# Altium project Humpback.PrjPCB (part 4 of 4)
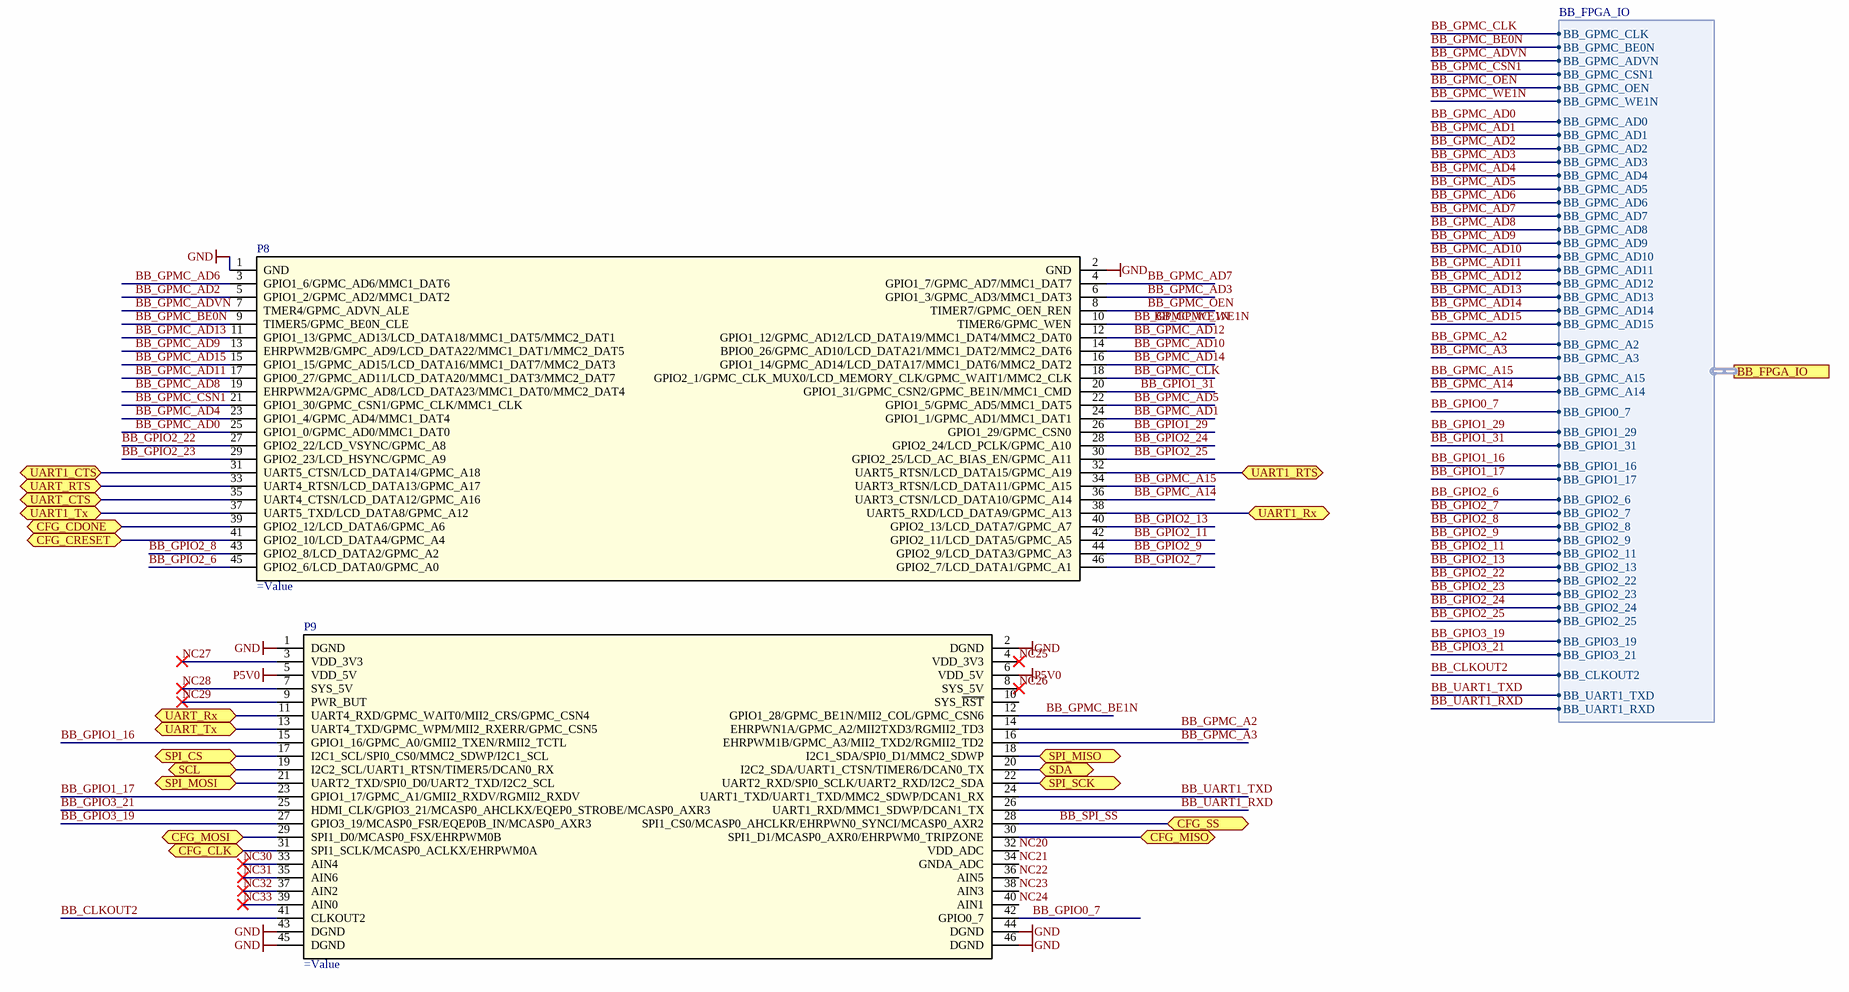
[diagram p11: Beaglebone_black.SchDoc]

## Nets that join several sheets
GND: FPGA_LVDS (27 pins), FPGA (14 pins), I2C_switch (14 pins), Supply (96 pins), FPGA_Config (18 pins), ESP32 (5 pins), Orange_pi_zero (5 pins), STM32_Nucleo_144 (10 pins), Wiznet (PCBM2.J2-17 PCBM2.J2-18 PCBM2.J2-19), Beaglebone_black (8 pins)
P3V3: FPGA (15 pins), Supply (34 pins), FPGA_Config (21 pins), ESP32 (PCBM1.2 R119.1 R122.1 W1.1), Wiznet (PCBM2.J2-1 PCBM2.J2-2 PCBM2.J2-3)
P3V3MP: FPGA_LVDS (J1.30 J2.30 J3.30), I2C_switch (27 pins), Supply (10 pins)
P5V0: Supply (24 pins), Orange_pi_zero (MOD1.2 MOD1.4), STM32_Nucleo_144 (MOD2.9a), Beaglebone_black (P9.5 P9.6)
P12V0: FPGA_LVDS (6 pins), Supply (11 pins)
BB_CLKOUT2: FPGA (U1.R9), Beaglebone_black (P9.41)
BB_GPIO0_7: FPGA (U1.R14), Beaglebone_black (P9.42)
BB_GPIO1_16: FPGA (U1.A16), Beaglebone_black (P9.15)
BB_GPIO1_17: FPGA (U1.R3), Beaglebone_black (P9.23)
BB_GPIO1_29: FPGA (U1.D11), Beaglebone_black (P8.26)
BB_GPIO1_31: FPGA (U1.D14), Beaglebone_black (P8.20)
BB_GPIO2_6: FPGA (U1.D16), Beaglebone_black (P8.45)
BB_GPIO2_7: FPGA (U1.C16), Beaglebone_black (P8.46)
BB_GPIO2_8: FPGA (U1.E16), Beaglebone_black (P8.43)
BB_GPIO2_9: FPGA (U1.D15), Beaglebone_black (P8.44)
BB_GPIO2_11: FPGA (U1.F15), Beaglebone_black (P8.42)
BB_GPIO2_13: FPGA (U1.F16), Beaglebone_black (P8.40)
BB_GPIO2_22: FPGA (U1.C11), Beaglebone_black (P8.27)
BB_GPIO2_23: FPGA (U1.C10), Beaglebone_black (P8.29)
BB_GPIO2_24: FPGA (U1.E10), Beaglebone_black (P8.28)
BB_GPIO2_25: FPGA (U1.D4), Beaglebone_black (P8.30)
BB_GPIO3_19: FPGA (U1.P4), Beaglebone_black (P9.27)
BB_GPIO3_21: FPGA (U1.R4), Beaglebone_black (P9.25)
BB_GPMC_A2: FPGA (U1.T7), Beaglebone_black (P9.14)
BB_GPMC_A3: FPGA (U1.T1), Beaglebone_black (P9.16)
BB_GPMC_A14: FPGA (U1.F9), Beaglebone_black (P8.36)
BB_GPMC_A15: FPGA (U1.B7), Beaglebone_black (P8.34)
BB_GPMC_AD0: FPGA (U1.C12), Beaglebone_black (P8.25)
BB_GPMC_AD1: FPGA (U1.E11), Beaglebone_black (P8.24)
BB_GPMC_AD2: FPGA (U1.J12), Beaglebone_black (P8.5)
BB_GPMC_AD3: FPGA (U1.J11), Beaglebone_black (P8.6)
BB_GPMC_AD4: FPGA (U1.C13), Beaglebone_black (P8.23)
BB_GPMC_AD5: FPGA (U1.C14), Beaglebone_black (P8.22)
BB_GPMC_AD6: FPGA (U1.J14), Beaglebone_black (P8.3)
BB_GPMC_AD7: FPGA (U1.J13), Beaglebone_black (P8.4)
BB_GPMC_AD8: FPGA (U1.E13), Beaglebone_black (P8.19)
BB_GPMC_AD9: FPGA (U1.G13), Beaglebone_black (P8.13)
BB_GPMC_AD10: FPGA (U1.G14), Beaglebone_black (P8.14)
BB_GPMC_AD11: FPGA (U1.G10), Beaglebone_black (P8.17)
BB_GPMC_AD12: FPGA (U1.E14), Beaglebone_black (P8.12)
BB_GPMC_AD13: FPGA (U1.H14), Beaglebone_black (P8.11)
BB_GPMC_AD14: FPGA (U1.F14), Beaglebone_black (P8.16)
BB_GPMC_AD15: FPGA (U1.F13), Beaglebone_black (P8.15)
BB_GPMC_ADVN: FPGA (U1.H12), Beaglebone_black (P8.7)
BB_GPMC_BE0N: FPGA (U1.G16), Beaglebone_black (P8.9)
BB_GPMC_CLK: FPGA (U1.H11), Beaglebone_black (P8.18)
BB_GPMC_CSN1: FPGA (U1.D13), Beaglebone_black (P8.21)
BB_GPMC_OEN: FPGA (U1.H13), Beaglebone_black (P8.8)
BB_GPMC_WE1N: FPGA (U1.G15), Beaglebone_black (P8.10)
BB_UART1_RXD: FPGA (U1.R5), Beaglebone_black (P9.26)
BB_UART1_TXD: FPGA (U1.T3), Beaglebone_black (P9.24)
CFG_CDONE: FPGA_Config (R34.1), ESP32 (PCBM1.5), Orange_pi_zero (MOD1.10), STM32_Nucleo_144 (MOD2.18c), Beaglebone_black (P8.39)
CFG_CLK: FPGA_Config (R10.1), ESP32 (PCBM1.30), Orange_pi_zero (MOD1.12), STM32_Nucleo_144 (MOD2.15c), Beaglebone_black (P9.31)
CFG_CRESET: FPGA_Config (R35.1), ESP32 (PCBM1.12), Orange_pi_zero (MOD1.16), STM32_Nucleo_144 (MOD2.20c), Beaglebone_black (P8.41)
CFG_MISO: FPGA_Config (R19.1), ESP32 (PCBM1.37), Orange_pi_zero (MOD1.18), STM32_Nucleo_144 (MOD2.19c), Beaglebone_black (P9.30)
CFG_MOSI: FPGA_Config (R5.1), ESP32 (PCBM1.31), Orange_pi_zero (MOD1.7), STM32_Nucleo_144 (MOD2.13c), Beaglebone_black (P9.29)
CFG_SS: FPGA_Config (R33.1), ESP32 (PCBM1.29), Orange_pi_zero (MOD1.26), STM32_Nucleo_144 (R88.1), Beaglebone_black (P9.28)
EEM0_I2C_SCL: FPGA_LVDS (J1.27), I2C_switch (B18.1 D1.3 IC6.15 R82.1)
EEM0_I2C_SDA: FPGA_LVDS (J1.26), I2C_switch (B17.1 D1.2 IC6.14 R80.1)
EEM1_I2C_SCL: FPGA_LVDS (J2.27), I2C_switch (B12.1 D2.3 IC6.8 R30.1)
EEM1_I2C_SDA: FPGA_LVDS (J2.26), I2C_switch (B11.1 D2.2 IC6.7 R29.1)
EEM2_I2C_SCL: FPGA_LVDS (J3.27), I2C_switch (5 pins)
EEM2_I2C_SDA: FPGA_LVDS (J3.26), I2C_switch (5 pins)
ESP32_IO2: FPGA (U1.D9), ESP32 (PCBM1.24)
ESP32_IO4: FPGA (U1.D7), ESP32 (PCBM1.26)
ESP32_IO22: FPGA (U1.C7), ESP32 (PCBM1.36)
ESP32_IO34: FPGA (U1.E9), ESP32 (PCBM1.6)
ESP32_IO35: FPGA (U1.C9), ESP32 (PCBM1.7)
FPGA_CDONE: FPGA (U1.M10), FPGA_Config (5 pins)
FPGA_CRESET: FPGA (U1.N11), FPGA_Config (JP1.9 R8.2 R35.2 R57.1)
FPGA_CSBSEL0: FPGA (U1.K11), FPGA_Config (R48.2 SW4.7)
FPGA_CSBSEL1: FPGA (U1.P13), FPGA_Config (R70.2 SW4.8)
FPGA_SCK: FPGA (U1.R11), FPGA_Config (5 pins)
FPGA_SCL: FPGA (U1.M12), I2C_switch (IC6.4 R22.1)
FPGA_SDA: FPGA (U1.T16), I2C_switch (IC6.3 R23.1)
FPGA_SDI: FPGA (U1.P11), FPGA_Config (IC1.2 IC17.9 JP1.3 R5.2)
FPGA_SDO: FPGA (U1.P12), FPGA_Config (5 pins)
FPGA_SS: FPGA (U1.R12), FPGA_Config (5 pins)
I2C_RESET: FPGA_LVDS (U1.B2), I2C_switch (R148.1 T1.1)
Orange_PG06: FPGA (U1.A15), Orange_pi_zero (MOD1.8)
SCL: I2C_switch (B20.1 IC6.17 R72.1 R86.1), ESP32 (PCBM1.8), Orange_pi_zero (MOD1.5), STM32_Nucleo_144 (MOD2.2c), Beaglebone_black (P9.19)
SDA: I2C_switch (B19.1 IC6.16 R36.1 R84.1), ESP32 (PCBM1.9), Orange_pi_zero (MOD1.3), STM32_Nucleo_144 (MOD2.4c), Beaglebone_black (P9.20)
SPI_CS: FPGA (U1.R2), ESP32 (PCBM1.23), Orange_pi_zero (MOD1.24), STM32_Nucleo_144 (MOD2.16c), Beaglebone_black (P9.17)
SPI_MISO: FPGA (U1.T2), ESP32 (PCBM1.16), Orange_pi_zero (MOD1.21), STM32_Nucleo_144 (MOD2.12c), Beaglebone_black (P9.18)
SPI_MOSI: FPGA (U1.N5), ESP32 (PCBM1.14), Orange_pi_zero (MOD1.19), STM32_Nucleo_144 (MOD2.14c), Beaglebone_black (P9.21)
SPI_SCK: FPGA (U1.C8), ESP32 (PCBM1.13), Orange_pi_zero (MOD1.23), STM32_Nucleo_144 (R65.2), Beaglebone_black (P9.22)
SPI_SCL: I2C_switch (IC6.6 R25.1), FPGA_Config (IC10.8)
SPI_SDA: I2C_switch (IC6.5 R24.1), FPGA_Config (IC10.7)
STM32_PA0: FPGA (U1.A2), STM32_Nucleo_144 (MOD2.29d)
STM32_PA1: FPGA (U1.P14), STM32_Nucleo_144 (MOD2.13b)
STM32_PA2: FPGA (U1.B8), STM32_Nucleo_144 (R101.1)
STM32_PA3: FPGA (U1.L13), STM32_Nucleo_144 (R90.1)
STM32_PA7: FPGA (U1.N12), STM32_Nucleo_144 (MOD2.15b)
STM32_PA8: FPGA (U1.M9), STM32_Nucleo_144 (MOD2.17b)
STM32_PA9: FPGA (U1.P10), STM32_Nucleo_144 (MOD2.19b)
STM32_PA10: FPGA (U1.R10), STM32_Nucleo_144 (MOD2.21b)
STM32_PA15: FPGA (U1.B14), STM32_Nucleo_144 (MOD2.9c)
STM32_PB0: FPGA (U1.A1), STM32_Nucleo_144 (MOD2.31d)
STM32_PB1: FPGA (U1.G12), STM32_Nucleo_144 (R94.1)
STM32_PB2: FPGA (U1.B6), STM32_Nucleo_144 (MOD2.15d)
STM32_PB6: FPGA (U1.A7), STM32_Nucleo_144 (MOD2.13d)
STM32_PB10: FPGA (U1.C3), STM32_Nucleo_144 (MOD2.32d)
STM32_PB11: FPGA (U1.F7), STM32_Nucleo_144 (MOD2.34d)
STM32_PB12: FPGA (U1.B13), STM32_Nucleo_144 (MOD2.7c)
STM32_PB13: FPGA (U1.B12), STM32_Nucleo_144 (MOD2.5c)
STM32_PB15: FPGA (U1.A11), STM32_Nucleo_144 (MOD2.3c)
STM32_PC0: FPGA (U1.L14), STM32_Nucleo_144 (R91.1)
STM32_PC1: FPGA (U1.M14), STM32_Nucleo_144 (R100.1)
STM32_PC2: FPGA (U1.A9), STM32_Nucleo_144 (R99.1)
STM32_PC3: FPGA (U1.M16), STM32_Nucleo_144 (R95.1)
STM32_PC4: FPGA (U1.N16), STM32_Nucleo_144 (R102.1)
STM32_PC5: FPGA (U1.P16), STM32_Nucleo_144 (R103.1)
STM32_PC6: FPGA (U1.B10), STM32_Nucleo_144 (MOD2.1c)
STM32_PC7: FPGA (U1.B15), STM32_Nucleo_144 (MOD2.11c)
STM32_PC8: FPGA (U1.H16), STM32_Nucleo_144 (MOD2.2a)
STM32_PC9: FPGA (U1.J10), STM32_Nucleo_144 (MOD2.4a)
STM32_PC10: FPGA (U1.J16), STM32_Nucleo_144 (MOD2.6a)
STM32_PC11: FPGA (U1.J15), STM32_Nucleo_144 (MOD2.8a)
STM32_PC12: FPGA (U1.K12), STM32_Nucleo_144 (MOD2.10a)
STM32_PD0: FPGA (U1.T9), STM32_Nucleo_144 (MOD2.25b)
STM32_PD1: FPGA (U1.N9), STM32_Nucleo_144 (MOD2.27b)
STM32_PD2: FPGA (U1.K13), STM32_Nucleo_144 (MOD2.12a)
STM32_PD7: FPGA (U1.L12), STM32_Nucleo_144 (MOD2.2b)
STM32_PD11: FPGA (U1.E5), STM32_Nucleo_144 (MOD2.23d)
STM32_PD12: FPGA (U1.D5), STM32_Nucleo_144 (MOD2.21d)
STM32_PD13: FPGA (U1.C5), STM32_Nucleo_144 (MOD2.19d)
STM32_PE0: FPGA (U1.D3), STM32_Nucleo_144 (MOD2.33d)
STM32_PE2: FPGA (U1.P15), STM32_Nucleo_144 (MOD2.14b)
STM32_PE3: FPGA (U1.N10), STM32_Nucleo_144 (MOD2.22b)
STM32_PE4: FPGA (U1.R15), STM32_Nucleo_144 (MOD2.16b)
STM32_PE5: FPGA (U1.T15), STM32_Nucleo_144 (MOD2.18b)
STM32_PE6: FPGA (U1.M8), STM32_Nucleo_144 (MOD2.20b)
STM32_PE7: FPGA (U1.E6), STM32_Nucleo_144 (MOD2.20d)
STM32_PE8: FPGA (U1.D6), STM32_Nucleo_144 (MOD2.18d)
STM32_PE9: FPGA (U1.F12), STM32_Nucleo_144 (MOD2.4d)
STM32_PE10: FPGA (U1.A5), STM32_Nucleo_144 (MOD2.24d)
STM32_PE11: FPGA (U1.G11), STM32_Nucleo_144 (MOD2.6d)
STM32_PE12: FPGA (U1.B4), STM32_Nucleo_144 (MOD2.26d)
STM32_PE13: FPGA (U1.F11), STM32_Nucleo_144 (MOD2.2d)
STM32_PE14: FPGA (U1.C4), STM32_Nucleo_144 (MOD2.28d)
STM32_PE15: FPGA (U1.B3), STM32_Nucleo_144 (MOD2.30d)
STM32_PF7: FPGA (U1.L9), STM32_Nucleo_144 (MOD2.26b)
STM32_PF8: FPGA (U1.L10), STM32_Nucleo_144 (MOD2.24b)
STM32_PF9: FPGA (U1.P9), STM32_Nucleo_144 (MOD2.28b)
STM32_PF14: FPGA (U1.B9), STM32_Nucleo_144 (MOD2.8d)
STM32_PG0: FPGA (U1.M7), STM32_Nucleo_144 (MOD2.29b)
STM32_PG1: FPGA (U1.P8), STM32_Nucleo_144 (MOD2.30b)
STM32_PG2: FPGA (U1.K14), STM32_Nucleo_144 (MOD2.14a)
STM32_PG3: FPGA (U1.K15), STM32_Nucleo_144 (MOD2.16a)
TEMP_SCL: I2C_switch (IC6.13 R42.1), Supply (R46.1)
TEMP_SDA: I2C_switch (IC6.12 R41.1), Supply (R45.1)
UART1_CTS: FPGA (U1.B16), STM32_Nucleo_144 (MOD2.12d), Wiznet (PCBM2.J2-12), Beaglebone_black (P8.31)
UART1_RTS: FPGA (U1.A6), STM32_Nucleo_144 (MOD2.10d), Wiznet (PCBM2.J2-11), Beaglebone_black (P8.32)
UART1_Rx: FPGA (U1.M11), STM32_Nucleo_144 (MOD2.16d), Wiznet (PCBM2.J2-9), Beaglebone_black (P8.38)
UART1_Tx: FPGA (U1.T13), STM32_Nucleo_144 (MOD2.14d), Wiznet (PCBM2.J2-10), Beaglebone_black (P8.37)
UART_CTS: FPGA (U1.T10), ESP32 (PCBM1.11), Orange_pi_zero (MOD1.15), STM32_Nucleo_144 (MOD2.10b), Wiznet (PCBM2.J2-16), Beaglebone_black (P8.35)
UART_RTS: FPGA (U1.M15), ESP32 (PCBM1.10), Orange_pi_zero (MOD1.22), STM32_Nucleo_144 (MOD2.8b), Wiznet (PCBM2.J2-15), Beaglebone_black (P8.33)
UART_Rx: FPGA (U1.M13), ESP32 (PCBM1.4), Orange_pi_zero (MOD1.11), STM32_Nucleo_144 (MOD2.4b), Wiznet (PCBM2.J2-13), Beaglebone_black (P9.11)
UART_Tx: FPGA (U1.T11), ESP32 (PCBM1.33), Orange_pi_zero (MOD1.13), STM32_Nucleo_144 (MOD2.6b), Wiznet (PCBM2.J2-14), Beaglebone_black (P9.13)
USR_LED: FPGA_LVDS (U1.H3), FPGA_Config (R26.1 T5.1)

## Assembly variants
beagle: not fitted MOD1 MOD2 PCBM1 PCBM2
STM32: not fitted MOD1 P8 P9 PCBM1 PCBM2
OrangePi: not fitted MOD2 P8 P9 PCBM2
Wiznet: not fitted MOD1 MOD2 P8 P9